# Altium schematic sheet MICandFilter_schematic.SchDoc
size A
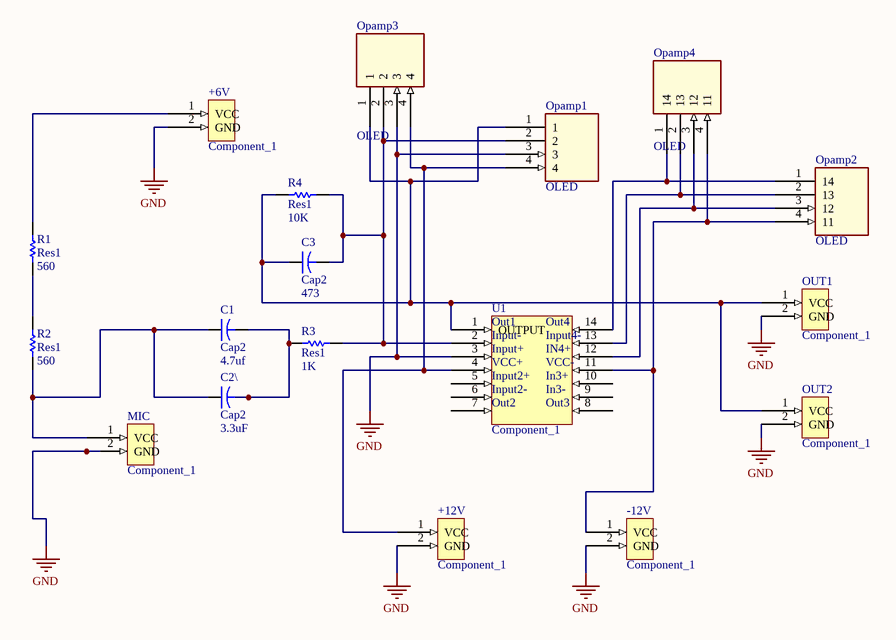
[diagram p0: MICandFilter_schematic.SchDoc]

## Parts
+6V  Component_1  [ConnectorBlue]
+12V  Component_1  [ConnectorBlue]
-12V  Component_1  [ConnectorBlue]
C1  Cap2  value 4.7uf  [CAPR5-4X5]
C2\  Cap2  value 3.3uF  [CAPR5-4X5]
C3  Cap2  value 473  [CAPR5-4X5]
MIC  Component_1  [ConnectorBlue]
Opamp1  OLED  [OLEDHEADER]
Opamp2  OLED  [OLEDHEADER]
Opamp3  OLED  [OLEDHEADER]
Opamp4  OLED  [OLEDHEADER]
OUT1  Component_1  [ConnectorBlue]
OUT2  Component_1  [ConnectorBlue]
R1  Res1  value 560  [AXIAL-0.3]
R2  Res1  value 560  [AXIAL-0.3]
R3  Res1  value 1K  [AXIAL-0.3]
R4  Res1  value 10K  [AXIAL-0.3]
U1  Component_1  [LM324N]

## Nets
GND: +6V.2(GND) +12V.2(GND) -12V.2(GND) MIC.2(GND) Opamp1.3 Opamp3.3 OUT1.2(GND) OUT2.2(GND) U1.3
Net+6V_1: +6V.1(VCC) R1.2
Net+12V_1: +12V.1(VCC) Opamp1.4 Opamp3.4 U1.4
Net-12V_1: -12V.1(VCC) Opamp2.4(11) Opamp4.4(11) U1.11
NetC1_1: C1.1 C2\.1 MIC.1(VCC) R2.1
NetC1_2: C1.2 C2\.2 R3.1
NetC3_1: C3.1 Opamp1.1 Opamp3.1 OUT1.1(VCC) OUT2.1(VCC) R4.2 U1.1(OUTPUT)
NetC3_2: C3.2 Opamp1.2 Opamp3.2 R3.2 R4.1 U1.2
NetOpamp2_1: Opamp2.1(14) Opamp4.1(14) U1.14
NetOpamp2_2: Opamp2.2(13) Opamp4.2(13) U1.13
NetOpamp2_3: Opamp2.3(12) Opamp4.3(12) U1.12
NetR1_1: R1.1 R2.2

Not connected (* = marked no-connect by the designer): U1 5 6 7 8 9 10

## Notes on the sheet
- (in symbol Component_1) Out1; Out4; Input-; Input4-; Input+; IN4+; VCC+; VCC-; Input2+; In3+; Input2-; In3-; Out2; Out3

## Library data of the parts
C1 C2\ C3 = Cap2: Capacitor; Published: 23-Sep-2002; PackageReference: CAPR5-4X5; Publisher: Altium Limited; PackageDescription: Capacitor; 2 Leads
R1-R4 = Res1: Resistor; Published: 8-Jun-2000; LatestRevisionDate: 17-Jul-2002; LatestRevisionNote: Re-released for DXP Platform.; PackageReference: AXIAL-0.3; Publisher: Altium Limited; PackageDescription: Axial Device, Thru-Hole; 2 Leads; 0.3 in Pin Spacing